# Altium schematic sheet Microcontroller.SchDoc
size A4; SheetNumber: 3; SheetTotal: 3
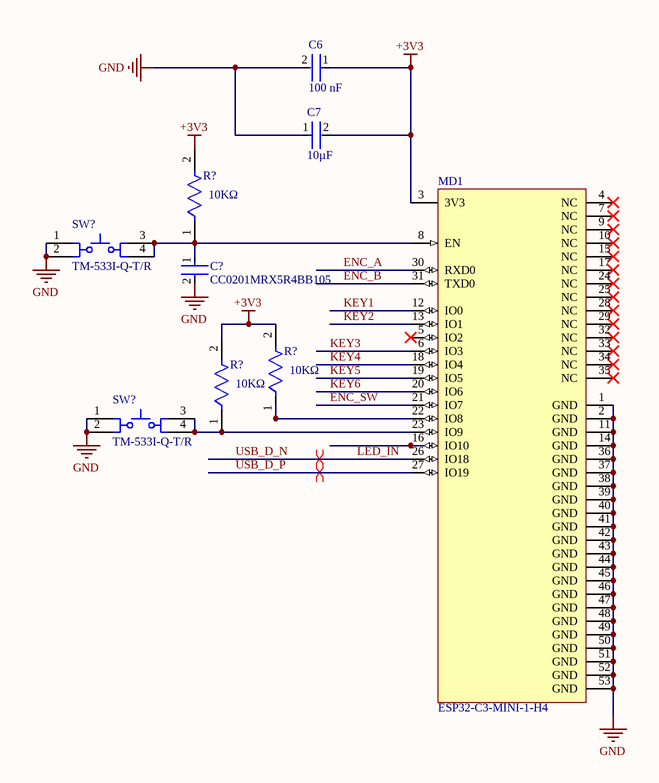
[diagram p0: Microcontroller.SchDoc]

## Parts
(Parts that share a designator on the sheet are numbered #1, #2 ... from top to bottom, then left to right.)
C6  value 100 nF  [FP-CC0603-DA-MFG]  (hidden comment: CC0603KRX7R6BB104)
C7  Capacitance: 10µF  [FP-CC0603-DC-MFG]  (hidden comment: 10uF)
C?  CC0201MRX5R4BB105  [FP-CC0201-BA-MFG]
MD1  ESP32-C3-MINI-1-H4  [FP-ESP32-C3-MINI-1-H4-MFG]
R?#1  value 10KΩ  [FP-CRGCQ1206-IPC_C]  (hidden comment: CRGCQ1206F10K)
R?#2  value 10KΩ  [FP-CRGCQ1206-IPC_C]  (hidden comment: CRGCQ1206F10K)
R?#3  value 10KΩ  [FP-CRGCQ1206-IPC_C]  (hidden comment: CRGCQ1206F10K)
SW?#1  TM-533I-Q-T/R  [MULT-TM-533I-Q_V]
SW?#2  TM-533I-Q-T/R  [MULT-TM-533I-Q_V]

## Nets
+3V3: C6.1 C7.2 MD1.3(3V3) R?#1.2 R?#2.2 R?#3.2
GND: C6.2 C7.1 C?.2 MD1.1(GND) MD1.2(GND) MD1.11(GND) MD1.14(GND) MD1.36(GND) MD1.37(GND) MD1.38(GND) MD1.39(GND) MD1.40(GND) MD1.41(GND) MD1.42(GND) MD1.43(GND) MD1.44(GND) MD1.45(GND) MD1.46(GND) MD1.47(GND) MD1.48(GND) MD1.49(GND) MD1.50(GND) MD1.51(GND) MD1.52(GND) MD1.53(GND) SW?#1.1 SW?#1.2 SW?#2.1 SW?#2.2
ENC_A: MD1.30(RXD0)
ENC_B: MD1.31(TXD0)
ENC_SW: MD1.21(IO7)
KEY1: MD1.12(IO0)
KEY2: MD1.13(IO1)
KEY3: MD1.6(IO3)
KEY4: MD1.18(IO4)
KEY5: MD1.19(IO5)
KEY6: MD1.20(IO6)
LED_IN: MD1.26(IO18)  [also labelled USB_D_N]
USB_D_P: MD1.27(IO19)
NetC?_1: C?.1 MD1.8(EN) R?#1.1 SW?#1.3 SW?#1.4
NetMD1_22: MD1.22(IO8) R?#2.1
NetMD1_23: MD1.23(IO9) R?#3.1 SW?#2.3 SW?#2.4

Not connected (* = marked no-connect by the designer): MD1 4(NC)* 5(IO2)* 7(NC)* 9(NC)* 10(NC)* 15(NC)* 16(IO10) 17(NC)* 24(NC)* 25(NC)* 28(NC)* 29(NC)* 32(NC)* 33(NC)* 34(NC)* 35(NC)*

## Layout directives
differential pair; rule Differential Pairs Routing [Pref Gap = 5.906mil    Min Gap  = 5.906mil    Max Gap  = 78.74milPref Width = 7.874mil    Min Width  = 5.118mil    Max Width  = 6.693mil]; rule Matched Net Lengths [Tolerance = 19.685mil]: LED_IN, USB_D_P

## Library data of the parts
C6 = CMP-03422-001228-1: CAP CER 0.1UF 10V X7R 0603; Manufacturer: YAGEO; Material: Ceramic; Tolerance: 0.1; Temperature Coefficient: 15%; Height: 0.9mm; RoHS: TRUE; Footprint Url: http://www.yageo.com/exep/pages/download/literatures/UPY-C_GEN_24.pdf; Octopart: https://octopart.com/cc0603krx7r6bb104-yageo-9291607; Device Class L1: Passive Components; Mouser Description: 0603 0.1 uF 10 V ±10 % Tolerance X7R SMT Multilayer Ceramic Capacitor; ComponentLink2URL: http://www.yageo.com/documents/recent/UPY-GPHC_X7R_6.3V-to-50V_18.pdf; Automotive: No; Voltage: 10 V; Capacitance: 100 nF; Device Class L3: Ceramic Capacitors; Category: Cap; Manufacturer Part Number: CC0603KRX7R6BB104; Temperature: -55°C to +125°C; ComponentLink2Description: Datasheet; Voltage Rating: 10 V; Device Class L2: Capacitors; Lead Free: Yes; Temperature Range High: +125°C; Temperature Range Low: -55°C; Digikey Description: CAP CER 0.1UF 10V X7R 0603; Package: CC0603-DA; Temperature Characteristic: X7R
C7 = CMP-00621-81932632-1: CC0603KRX5R7BB106 Multilayer Ceramic Capacitor, 10 uF, 16 V, ± 10%, X5R, 0603 [1608 Metric]; Voltage Rating: 16V; NexarPartId: 81932632; Height: 1mm; Halogen Free: Halogen Free; Dielectric: X5R; Max Operating Temperature: 85°C; Voltage Rating (DC): 16V; Material: Ceramic; Lead Free: Lead Free; Tolerance: 10%; RoHS: Non-Compliant; Min Operating Temperature: -55°C; Case/Package: 0603
C? = CMP-03422-000877-2: CAP CER 1UF 4V X5R 0201; Manufacturer: Yageo; Tolerance: 0.2; Description: CC0201 1 uF X5R 20.00% 4 V; Material: Ceramic; Temperature Coefficient: 15%; Category: Cap; Value: 1 uF; Temperature Range High: +85°C; RoHS: TRUE; Package: CC0201-BA; Height: 0.33mm; Device Class L3: Ceramic Capacitors; Temperature Characteristic: X5R; Digikey Description: CAP CER 1UF 4V X5R 0201; Octopart: https://octopart.com/cc0201mrx5r4bb105-yageo-81932620; Ipc Land Pattern Name: CAPC6030X30; Voltage Rating: 4 V; Device Class L2: Capacitors; Temperature: -55°C to +85°C; ComponentLink2URL: http://www.yageo.com/documents/recent/UPY-GPHC_X5R_4V-to-50V_25.pdf; Lead Free: Yes; Capacitance: 1 uF; ComponentLink2Description: Datasheet; Manufacturer Part Number: CC0201MRX5R4BB105; Temperature Range Low: -55°C; Device Class L1: Passive Components; Footprint Url: http://www.yageo.com/exep/pages/download/literatures/UPY-C_GEN_24.pdf; Automotive: No
MD1 = CMP-10700-116589974-1: Multiprotocol Modules SMD module, ESP32-C3FH4, PCB antenna, -40 C +105 C; Data Rate: 150Mbps; Number of GPIO: 13; Current - Transmitting: 350mA; Max Frequency: 2.484GHz; Current - Receiving: 84mA; Max Supply Voltage: 3.6V; Min Supply Voltage: 3V; Interface: SPI; Min Operating Temperature: -40°C; Height: 2.55mm; Ambient Temperature Range High: 85°C; Max Operating Temperature: 85°C
R?#1-R?#3 = CMP-03211-010884-1: CRGCQ1206 10KΩ 0.25W 1% ±100ppm/°C 200V; Manufacturer: TE Connectivity; Tolerance: 0.01; Automotive Grade: Grade 913; Automotive: Yes; Temperature: -55°C to +155°C; RoHS: TRUE; Series: CRGCQ; Lead Free: Yes; Device Class L3: Chip SMD Resistors; Package: CRGCQ1206; ComponentLink2URL: https://www.te.com/commerce/DocumentDelivery/DDEController?Action=showdoc&DocId=Data+Sheet%7F1773204-3%7F1%7Fpdf%7FEnglish%7FENG_DS_1773204-3_1.pdf%7F4-2176347-922; Ipc Land Pattern Name: RESC310155X55; Composition: Thick Film; Voltage Rating: 200V; Device Class L1: Passive Components; Temperature Range Low: -55°C; Resistance: 10KΩ; Height: 0.65mm; Power Rating: 0.25W; Device Class L2: Resistors; Temperature Range High: +155°C; Octopart: https://octopart.com/crgcq1206f10k-te+connectivity-91018244; Ambient Temperature Range High: +70°C; ComponentLink2Description: Datasheet; Temperature Coefficient: ±100ppm/°C; Manufacturer Part Number: CRGCQ1206F10K; Category: Res
SW?#1 SW?#2 = CMP-1762-00001-1: TACT Switch, SPNO, -25 to 70 degC, 4-Pin SMD, RoHS, Tape and Reel; PackageDescription: 4-Pin Surface Mount Device, Body 5.2 x 5.2 mm; PackageReference: TM-533I-Q-T/R; DatasheetVersion: Rev. 1.1, 12/2011; ComponentLink1Description: Datasheet; ComponentLink1URL: http://www.micropik.com/PDF/pul5x5.pdf